# Altium project Single_visual_acqusation.PrjPcb
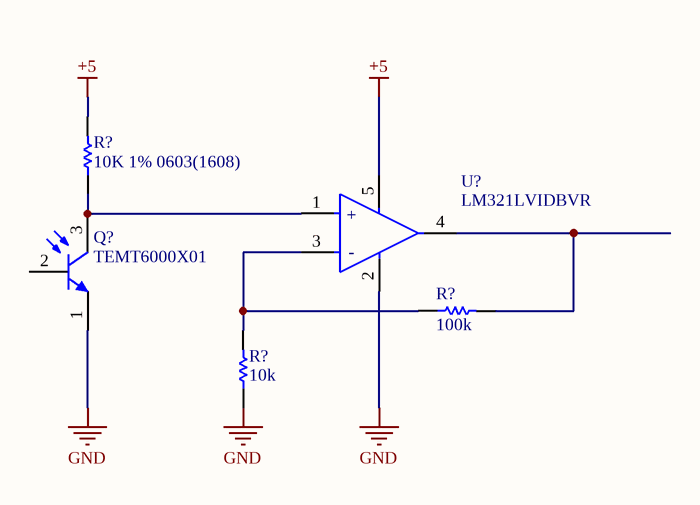
[diagram p0: single_visual_acqusation_sch.SchDoc]
1 sheet, 5 parts. Net scope: global (net labels, ports and power ports of the same name join across sheets).
Board file: single_visual_acqusation_pcb.PcbDoc

## Sheet single_visual_acqusation_sch.SchDoc
size A3; Organization: Altium Limited; Address1: L3, 12a Rodborough Rd; Address2: Frenchs Forest; Address3: NSW; Address4: Australia 2086

### Parts
(Parts that share a designator on the sheet are numbered #1, #2 ... from top to bottom, then left to right.)
Q?  TEMT6000X01  [VSIL-TEMT6000X01_V]
R?#1  10K 1% 0603(1608)  [RESC0603(1608)_N]
R?#2  100k  [RESC1608X55X30ML15T15]
R?#3  10k  [RESC1608X55X30ML15T15]
U?  LM321LVIDBVR  [FP-LM321LVIDBVR-MFG]

### Nets
+5: R?#1.2 U?.5(V+)
GND: Q?.1(E) R?#3.1 U?.2(V-)
NetQ?_3: Q?.3(C) R?#1.1 U?.1(IN+)
NetR?#2_1: R?#2.1 R?#3.2 U?.3(IN-)
NetR?#2_2: R?#2.2 U?.4(OUT)

Not connected (* = marked no-connect by the designer): Q? 2(B)

### Notes on the sheet
- Title
- Size:
- Date:
- A3
- Number:
- Time:
- Revision:
- Sheet
- of
- File:
- (in symbol CMP-04895-000016-1) +; -

### Library data of the parts
Q? = CMP-1666-00035-1: Ambient Light Sensor / , 100 mW, -40 to 100 degC, 3-Pin SMD, RoHS, Tape and Reel; Nominal Vf: 2 V; Luminous Intensity: 54 mcd; Forward Current: 20 mA; Viewing Angle: 130 degrees; Lens Style: Diffused; Power Rating: 75 mW; Colour: Red; Case\Package: 0603; Case Code (Imperial): 0603; Package Quantity: 3000; Packaging: Tape and Reel; Width: 0.8 mm; ComponentLink2URL: http://www.vishay.com/docs/81579/temt6000.pdf; ComponentLink1Description: Manufacturer URL; ComponentLink2Description: Datasheet; Height: 0.8 mm; Mount: Surface Mount; Pins: 2; Case Code (Metric): 1608; Max Operating Temperature: 85 degC; DatasheetVersion: Rev. 1.9, 08/2011; Forward Voltage: 2 V; ComponentLink1URL: http://www.vishay.com/; Radiation Hardening: No; RoHSCompliant: true; Length: 1.6 mm; PackageReference: 1206; Min Operating Temperature: -55 degC; PackageDescription: 3-Pin Surface Mount Device, Body 4 x 2 mm; Illumination Colour: Red
R?#1 = CMP-1012-00623-1: 10K 0.1W 1% 0603 (1608 Metric)  SMD; Value: 10000.00 Ohm; Case-EIA: 0603; Case-Metric: 1608; Power: 0.1 W; Tolerance: 1 %; Technology: SMT
R?#2 R?#3 = CMP-2000-00180-1: Part Number: ERJ-3EKF1001V; Manufacturer: Panasonic
U? = CMP-04895-000016-1: IC OPAMP GP 1 CIRCUIT SOT23-5; Manufacturer: Texas Instruments; Gain Bandwidth: 1MHz; Min Supply Voltage: 2.7V; Output Current Per Channel: 40mA; Number Of Channels: 1; Nominal Supply Current: 90uA; Response Time: 5us; Max Junction Temp: +150°C; Max Supply Voltage: 5.5V; Max Dual Supply Voltage: 2.75V; Input Offset Voltage: 1mV; Standoff Height: 0mm; Voltage Gain: 125dB; Input Bias Current: 0.000015uA; Min Dual Supply Voltage: 1.35V; Description: General Purpose Amplifier 1 Circuit  SOT-23-5; ComponentLink2Description: Datasheet; Device Class L1: Integrated Circuits (ICs); Device Class L2: Linear ICs; Package: SOT-23-5; RoHS: TRUE; Digikey Description: IC OPAMP GP 1 CIRCUIT SOT23-5; Octopart: https://octopart.com/lm321lvidbvr-texas+instruments-95825365; Temperature Range High: +125°C; Temperature: -40°C to +125°C; Mouser Description: 1-Channel industry standard low voltage operational amplifier 5-SOT-23 -40 to 125; Height: 1.45mm; Ambient Temperature Range High: +125°C; Manufacturer Part Number: LM321LVIDBVR; Device Class L3: Amplifiers - Op Amps; Ambient Temperature Range Low: -40°C; Lead Free: Yes; Category: IC; Temperature Range Low: -40°C; Automotive: No; ComponentLink2URL: http://www.ti.com/lit/ds/symlink/lm321lv.pdf